# Altium project UltiSID.PrjPcb
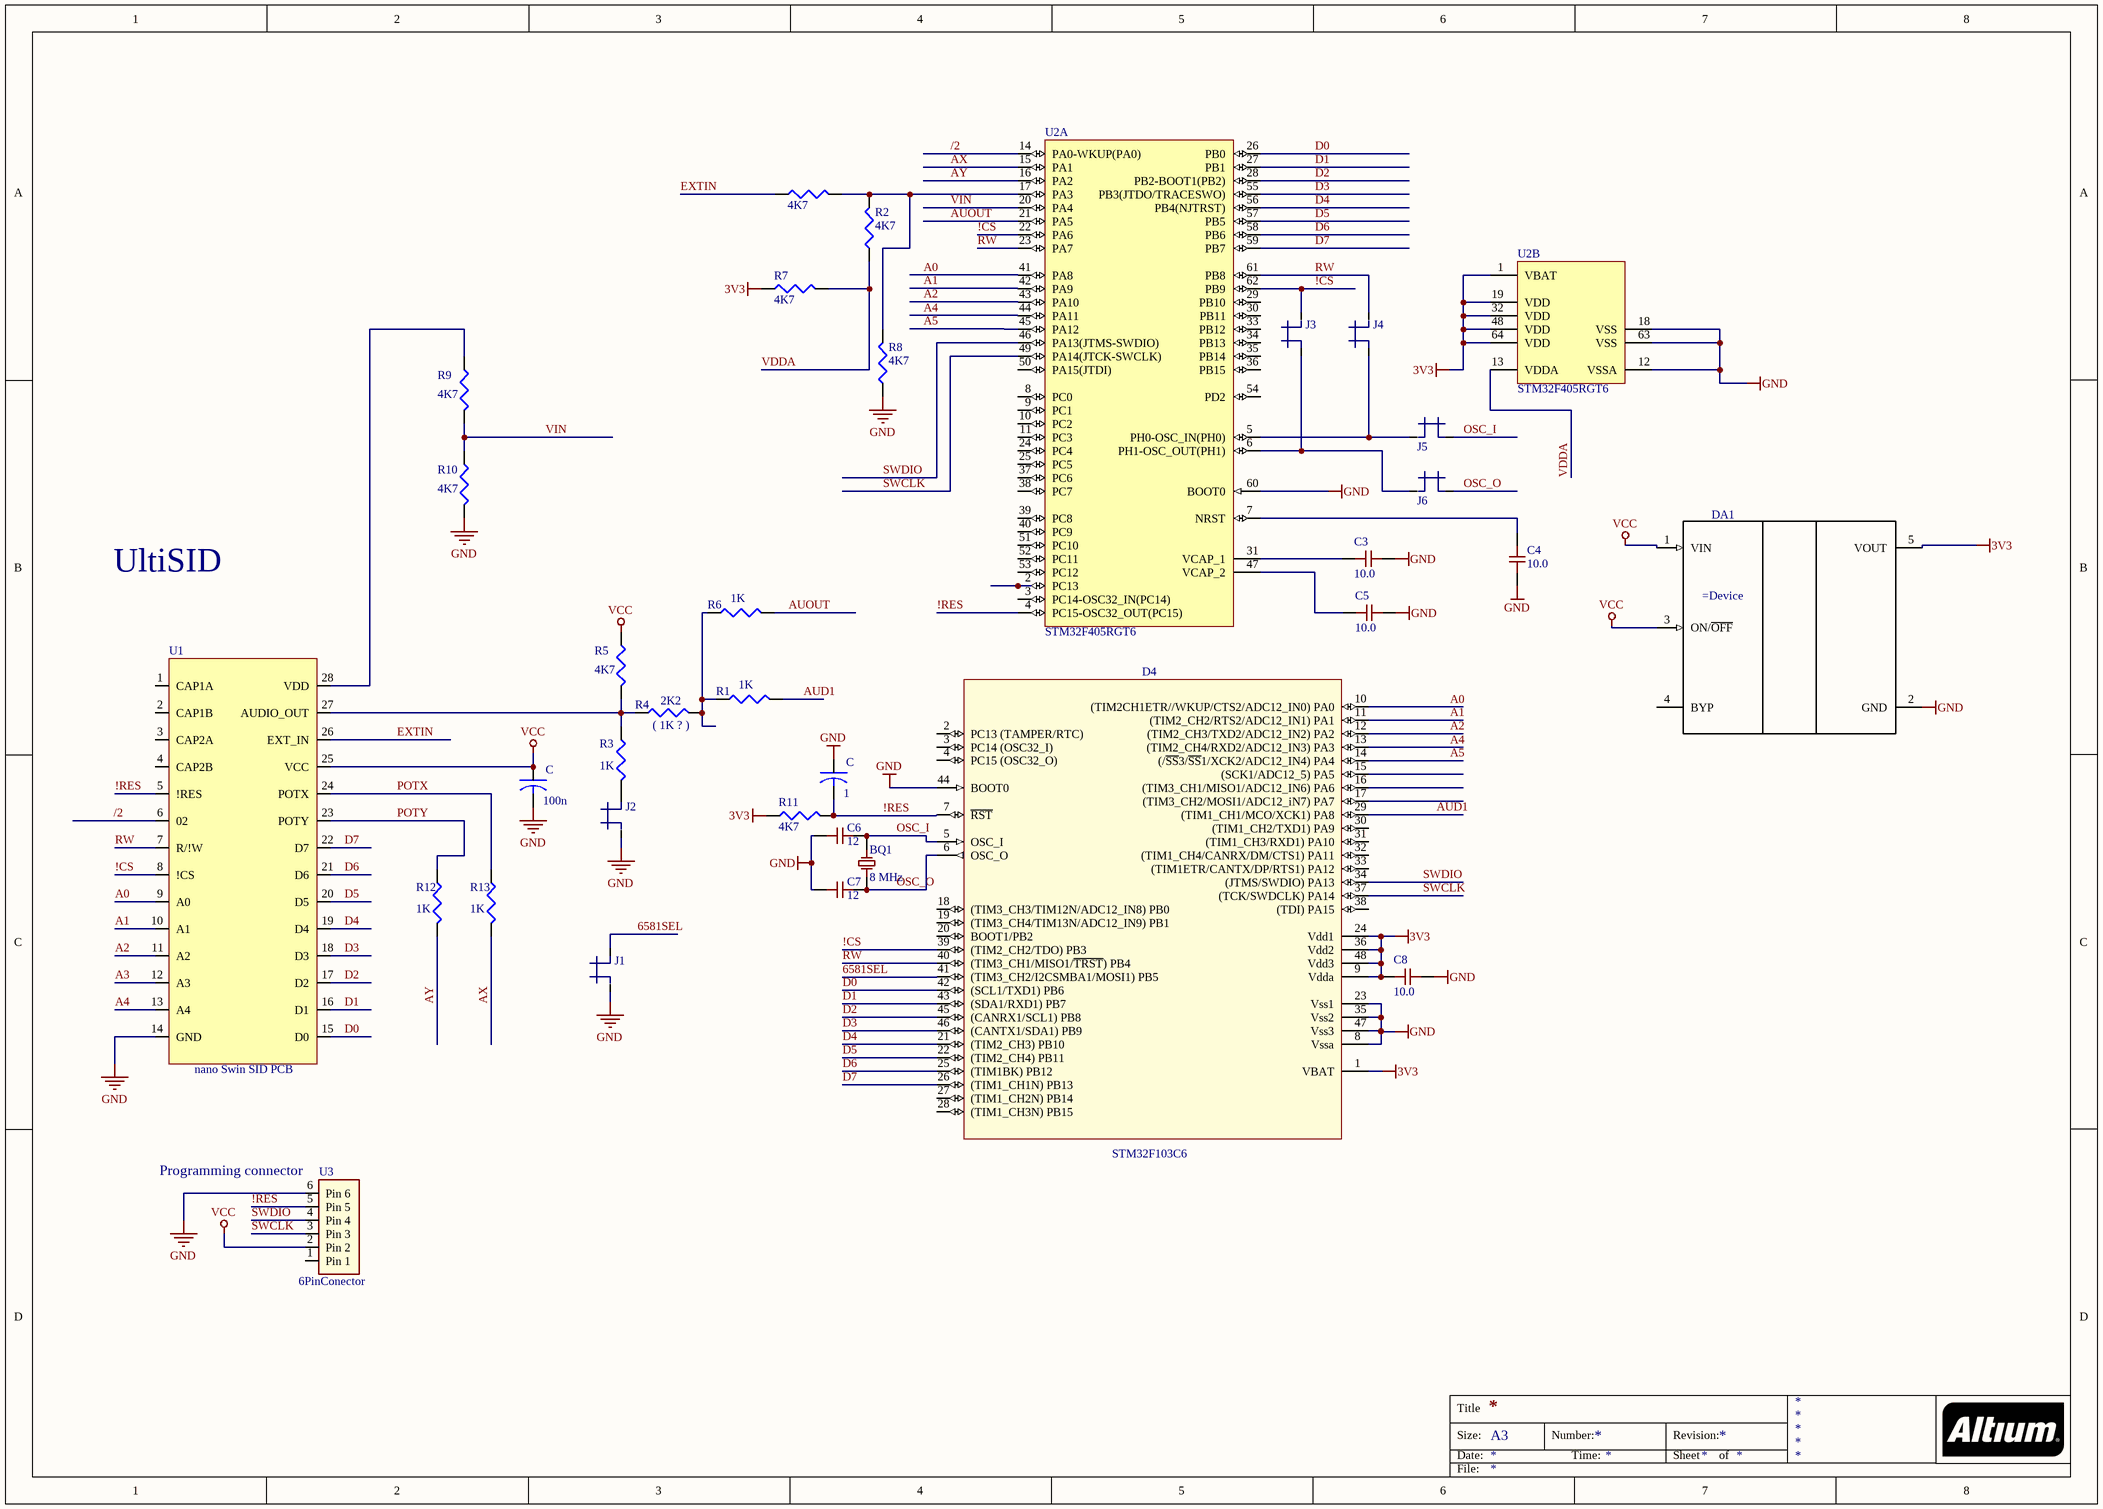
[diagram p0: UltiSID.SchDoc]
3 sheets, 34 parts. Net scope: global (net labels, ports and power ports of the same name join across sheets).
Board file: UltiSID.PcbDoc
Sheets:
  ProgrammerConector.SchDoc
  PowerBoard.SchDoc
  UltiSID.SchDoc

## Sheet ProgrammerConector.SchDoc
size A4

## Sheet PowerBoard.SchDoc
size A4

## Sheet UltiSID.SchDoc
size A3

### Parts
1  C  [THROUGH HOLE - CAP POL (mini)]
100n  C  [THROUGH HOLE - CAP POL (mini)]
BQ1  value 8 MHz  [XTAL3225]  (hidden comment: XTAL)
C3  value 10.0  [C-0805]  (hidden comment: CAP)
C4  value 10.0  [C-0805]  (hidden comment: CAP)
C5  value 10.0  [C-0805]  (hidden comment: CAP)
C6  value 12  [C-0603]  (hidden comment: CAP)
C7  value 12  [C-0603]  (hidden comment: CAP)
C8  value 10.0  [C-0805]  (hidden comment: CAP)
D4  value STM32F103C6  [TQFP48_L]  (hidden comment: Microcontroller)
DA1  (no value)  [SOT95P280X145-5N]
J1  Jumper  [2-PIN HEADER SMALL 2mm]  (value not drawn)
J2  Jumper  [2-PIN HEADER SMALL 2mm]  (value not drawn)
J3  Jumper  [2-PIN HEADER SMALL 2mm]  (value not drawn)
J4  Jumper  [2-PIN HEADER SMALL 2mm]  (value not drawn)
J5  Jumper  [2-PIN HEADER SMALL 2mm]  (value not drawn)
J6  Jumper  [2-PIN HEADER SMALL 2mm]  (value not drawn)
R1  1K  [SMD-0805 - R]
R2  4K7  [SMD-0805 - R]
R3  1K  [SMD-0805 - R]
R4  2K2  [SMD-0805 - R]
R5  4K7  [SMD-0805 - R]
R6  1K  [SMD-0805 - R]
R7  4K7  [SMD-0805 - R]
R8  4K7  [SMD-0805 - R]
R9  4K7  [SMD-0805 - R]
R10  4K7  [SMD-0805 - R]
R11  4K7  [SMD-0805 - R]
R12  1K  [SMD-0805 - R]
R13  1K  [SMD-0805 - R]
U1  nano Swin SID PCB  [DIP-28-AY-38192-SID]
U2  STM32F405RGT6  [STM-LQFP64_N]  (parts A,B of 2)
U3  6PinConector  [6-PIN HEADER small 1.27mm]
  4K7  [SMD-0805 - R]

### Nets
3V3: C8.1 D4.1(VBAT) D4.9(Vdda) D4.24(Vdd1) D4.36(Vdd2) D4.48(Vdd3) DA1.5(VOUT) R7.1 R11.1 U2.1(VBAT) U2.19(VDD) U2.32(VDD) U2.48(VDD) U2.64(VDD)
GND: 1.1 100n.2 C3.2 C4.1 C5.2 C6.2 C7.2 C8.2 D4.8(Vssa) D4.23(Vss1) D4.35(Vss2) D4.44(BOOT0) D4.47(Vss3) DA1.2(GND) J1.2 J2.2 R8.1 R10.2 U1.14(GND) U2.12(VSSA) U2.18(VSS) U2.60(BOOT0) U2.63(VSS) U3.6(Pin_6)
VCC: 100n.1 DA1.1(VIN) DA1.3(ON/~{OFF}) R5.1 U1.25(VCC) U3.2(Pin_2)
6581SEL: D4.41((TIM3_CH2/I2CSMBA1/MOSI1)_PB5) J1.1
!CS: D4.39((TIM2_CH2/TDO)_PB3) J3.1 U1.8(!CS) U2.22(PA6) U2.62(PB9)
!RES: 1.2 D4.7(~{RST}) R11.2 U1.5(!RES) U2.4(PC15-OSC32_OUT(PC15)) U3.5(Pin_5)
/2: U1.6(02) U2.14(PA0-WKUP(PA0))
A0: D4.10((TIM2CH1ETR//WKUP/CTS2/ADC12_IN0)_PA0) U1.9(A0) U2.41(PA8)
A1: D4.11((TIM2_CH2/RTS2/ADC12_IN1)_PA1) U1.10(A1) U2.42(PA9)
A2: D4.12((TIM2_CH3/TXD2/ADC12_IN2)_PA2) U1.11(A2) U2.43(PA10)
A3: U1.12(A3)
A4: D4.13((TIM2_CH4/RXD2/ADC12_IN3)_PA3) U1.13(A4) U2.44(PA11)
A5: D4.14((/~{SS}3/~{SS}1/XCK2/ADC12_IN4)_PA4) U2.45(PA12)
AUD1: D4.29((TIM1_CH1/MCO/XCK1)_PA8) R1.2
AUOUT: R6.2 U2.21(PA5)
AX: R13.2 U2.15(PA1)
AY: R12.2 U2.16(PA2)
D0: D4.42((SCL1/TXD1)_PB6) U1.15(D0) U2.26(PB0)
D1: D4.43((SDA1/RXD1)_PB7) U1.16(D1) U2.27(PB1)
D2: D4.45((CANRX1/SCL1)_PB8) U1.17(D2) U2.28(PB2-BOOT1(PB2))
D3: D4.46((CANTX1/SDA1)_PB9) U1.18(D3) U2.55(PB3(JTDO/TRACESWO))
D4: D4.21((TIM2_CH3)_PB10) U1.19(D4) U2.56(PB4(NJTRST))
D5: D4.22((TIM2_CH4)_PB11) U1.20(D5) U2.57(PB5)
D6: D4.25((TIM1BK)_PB12) U1.21(D6) U2.58(PB6)
D7: D4.26((TIM1_CH1N)_PB13) U1.22(D7) U2.59(PB7)
EXTIN: U1.26(EXT_IN) .1
OSC_I: BQ1.1 C6.1 D4.5(OSC_I) J5.1
OSC_O: BQ1.2 C7.1 D4.6(OSC_O) J6.1
POTX: R13.1 U1.24(POTX)
POTY: R12.1 U1.23(POTY)
RW: D4.40((TIM3_CH1/MISO1/~{TRST})_PB4) J4.1 U1.7(R/!W) U2.23(PA7) U2.61(PB8)
SWCLK: D4.37((TCK/SWDCLK)_PA14) U2.49(PA14(JTCK-SWCLK)) U3.3(Pin_3)
SWDIO: D4.34((JTMS/SWDIO)_PA13) U2.46(PA13(JTMS-SWDIO)) U3.4(Pin_4)
VDDA: R2.1 R7.2 U2.13(VDDA)
VIN: R9.2 R10.1 U2.20(PA4)
NetC3_1: C3.1 U2.31(VCAP_1)
NetC4_2: C4.2 U2.7(NRST)
NetC5_1: C5.1 U2.47(VCAP_2)
NetJ2_1: J2.1 R3.2
NetJ3_2: J3.2 J6.2 U2.6(PH1-OSC_OUT(PH1))
NetJ4_2: J4.2 J5.2 U2.5(PH0-OSC_IN(PH0))
NetR1_1: R1.1 R4.2 R6.1
NetR2_2: R2.2 R8.2 U2.17(PA3) .2
NetR3_1: R3.1 R4.1 R5.2 U1.27(AUDIO_OUT)
NetR9_1: R9.1 U1.28(VDD)

Not connected (* = marked no-connect by the designer): D4 2(PC13_(TAMPER/RTC)) 3(PC14_(OSC32_I)) 4(PC15_(OSC32_O)) 15((SCK1/ADC12_5)_PA5) 16((TIM3_CH1/MISO1/ADC12_IN6)_PA6) 17((TIM3_CH2/MOSI1/ADC12_iN7)_PA7) 18((TIM3_CH3/TIM12N/ADC12_IN8)_PB0) 19((TIM3_CH4/TIM13N/ADC12_IN9)_PB1) 20(BOOT1/PB2) 27((TIM1_CH2N)_PB14) 28((TIM1_CH3N)_PB15) 30((TIM1_CH2/TXD1)_PA9) 31((TIM1_CH3/RXD1)_PA10) 32((TIM1_CH4/CANRX/DM/CTS1)_PA11) 33((TIM1ETR/CANTX/DP/RTS1)_PA12) 38((TDI)_PA15); DA1 4(BYP); U1 1(CAP1A) 2(CAP1B) 3(CAP2A) 4(CAP2B); U2 2(PC13) 3(PC14-OSC32_IN(PC14)) 8(PC0) 9(PC1) 10(PC2) 11(PC3) 24(PC4) 25(PC5) 29(PB10) 30(PB11) 33(PB12) 34(PB13) 35(PB14) 36(PB15) 37(PC6) 38(PC7) 39(PC8) 40(PC9) 50(PA15(JTDI)) 51(PC10) 52(PC11) 53(PC12) 54(PD2); U3 1(Pin_1)

### Notes on the sheet
- UltiSID
- (near R4) ( 1K ? )
- (near U3) Programming connector
- Title
- Size:
- Date:
- A3
- Number:
- Time:
- Revision:
- Sheet
- of
- File:

### Library data of the parts
BQ1 = XTAL: Crystal Oscillator; Manufacturer: NDK; Part Number: NX3225GD-8MHZ-STD-CRA-3; Parameters: 8 MHz 8pF 50 ppm; Tolerance: 50 ppm; Unit Price: *; Package: 3225
C3-C5 C8 = CAP: Capacitor; Manufacturer: Yageo; Part Number: 0805-10uF 10V +/-10% X7R; Alt Part Num: CC0805KKX7R6BB106; Parameters: X7R, 10V; Tolerance: 10%; Unit Price: 0.0359; Package: 0805
C6 C7 = CAP: Capacitor; Manufacturer: Samsung; Part Number: 0603-12pF 50V +/-5% NP0; Alt Part Num: CL10C120JB8NNNC; Parameters: NP0, 50V; Tolerance: 5%; Unit Price: 0.0018; Package: 0603
D4 = STM32F103Cx: MC Cortex-M3; Manufacturer: ST; Part Number: STM32F103C6T6A; Parameters: 16-32K; Package: LQFP-48; Unit Price: *
DA1 = LP2985: 150mA Low-Noise Low-Dropout Regulator Whit Shutdown
R1-R13  = R
U1 = MOS6581_SID
U2 = STM32F405RGT6: ARM Cortex-M4 32-bit MCU+FPU, 210 DMIPS, 1024 kB Flash, 192 kB Internal RAM, 51 I/Os, 64-pin LQFP, -40 to 85 degC, Tray; Manufacturer: STMicroelectronics; D/A Converter: 2x12-bit; FLASH Size (Prog) (kB): 1024; I/Os (High Current): 51; Internal RAM Size (kB): 192; Operating Frequency(F) (Processor speed) (MHz): 168; Supply Voltage(Vcc) max (V): 3.6; Supply Voltage(Vcc) min (V): 1.8; DatasheetVersion: Rev. 4; PackageVersion: Rev. 4, 06/2013; PackageReference: LQFP64; PackageDescription: 64-Pin Low Profile Quad Flat Package, 10 x 10 mm Body, 0.5 mm Pitch; Supplier 1: Digi-Key; Supplier Part Number 1: 497-11767-ND; Supplier 2: Farnell; Supplier Part Number 2: 2064363; Supplier 3: Newark; Supplier Part Number 3: 73T2329; Supplier 4: Mouser; Supplier Part Number 4: 511-STM32F405RGT6; Core: ARM Cortex-M4; Packing: Tray; Mounting Technology: Surface Mount; PartNumber: STM32F405RGT6; ComponentLink1Description: Manufacturer URL; ComponentLink1URL: http://www.st.com/web/en/home.html; ComponentLink2Description: Datasheet; ComponentLink2URL: http://www.st.com/st-web-ui/static/active/en/resource/technical/document/datasheet/DM00037051.pdf; ComponentLink3Description: Package Specification; ComponentLink3URL: http://www.st.com/st-web-ui/static/active/en/resource/technical/document/datasheet/DM00037051.pdf